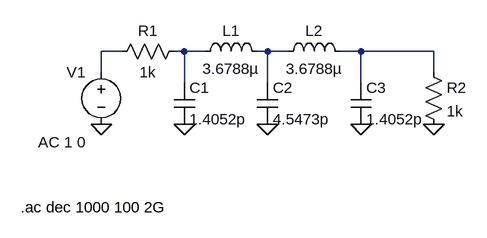
[diagram p0: schematic RLC.asc]
RLC.asc, the LTspice schematic file:
Version 4
SHEET 1 880 680
WIRE 32 112 0 112
WIRE 128 112 112 112
WIRE 160 112 128 112
WIRE 256 112 240 112
WIRE 288 112 256 112
WIRE 400 112 368 112
WIRE 512 112 400 112
WIRE 0 144 0 112
WIRE 512 144 512 112
WIRE 128 160 128 112
WIRE 256 160 256 112
WIRE 400 160 400 112
FLAG 128 224 0
FLAG 256 224 0
FLAG 400 224 0
FLAG 512 224 0
FLAG 0 224 0
SYMBOL res 128 96 R90
WINDOW 0 0 56 VBottom 2
WINDOW 3 32 56 VTop 2
SYMATTR InstName R1
SYMATTR Value 1k
SYMBOL cap 112 160 R0
SYMATTR InstName C1
SYMATTR Value 1.4052p
SYMBOL cap 240 160 R0
SYMATTR InstName C2
SYMATTR Value 4.5473p
SYMBOL cap 384 160 R0
SYMATTR InstName C3
SYMATTR Value 1.4052p
SYMBOL ind 144 128 R270
WINDOW 0 32 56 VTop 2
WINDOW 3 5 56 VBottom 2
SYMATTR InstName L1
SYMATTR Value 3.6788µ
SYMBOL ind 272 128 R270
WINDOW 0 32 56 VTop 2
WINDOW 3 5 56 VBottom 2
SYMATTR InstName L2
SYMATTR Value 3.6788µ
SYMBOL res 496 128 R0
SYMATTR InstName R2
SYMATTR Value 1k
SYMBOL voltage 0 128 M0
WINDOW 123 24 124 Left 2
WINDOW 39 0 0 Left 0
SYMATTR InstName V1
SYMATTR Value ""
SYMATTR Value2 AC 1 0
TEXT -124 352 Left 2 !.ac dec 1000 100 2G

The netlist it stands for:
* RLC.asc
R1 N002 N001 1k
C1 N002 0 1.4052p
C2 N003 0 4.5473p
C3 N004 0 1.4052p
L1 N002 N003 3.6788µ
L2 N003 N004 3.6788µ
R2 N004 0 1k
V1 N001 0 AC 1 0
.ac dec 1000 100 2G
.backanno
.end